# Altium project BLDC-Board-v1.0.PrjPcb (part 1 of 3)
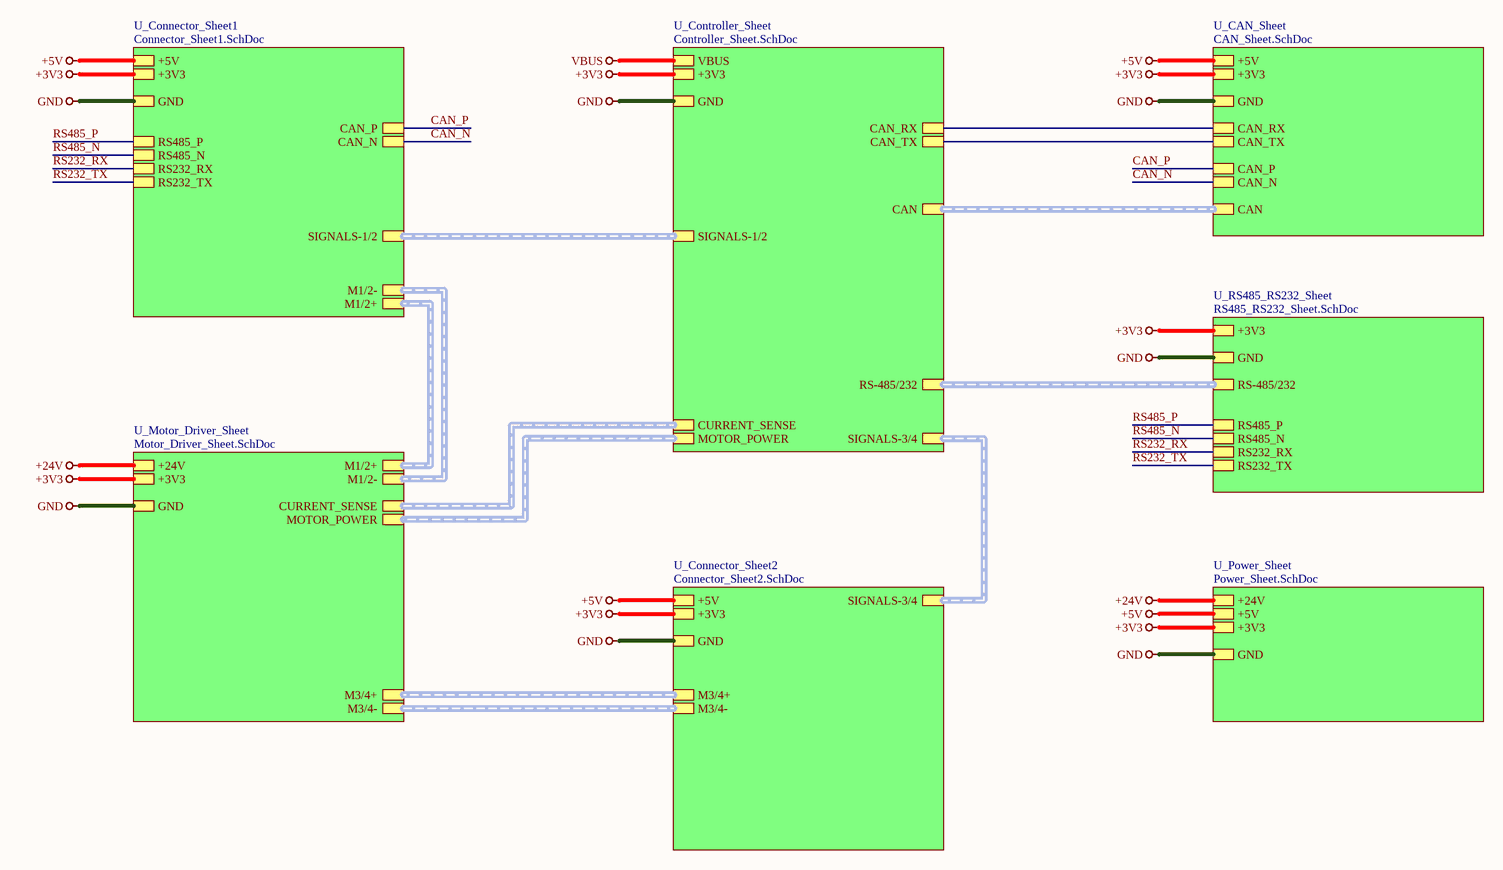
[diagram p0: Top_Sheet.SchDoc]
8 sheets, 211 parts. Net scope: hierarchical (ports join the sheet entries above them; power ports are global).
Board file: BLDC-Board-v1.0.PcbDoc
Sheets:
  Top_Sheet.SchDoc
    U_CAN_Sheet = CAN_Sheet.SchDoc
    U_Connector_Sheet1 = Connector_Sheet1.SchDoc
    U_Connector_Sheet2 = Connector_Sheet2.SchDoc
    U_Controller_Sheet = Controller_Sheet.SchDoc
    U_Motor_Driver_Sheet = Motor_Driver_Sheet.SchDoc
    U_Power_Sheet = Power_Sheet.SchDoc
    U_RS485_RS232_Sheet = RS485_RS232_Sheet.SchDoc

## Sheet Top_Sheet.SchDoc
size 420 x 297 mm; SheetNumber: 1; SheetTotal: 8

### Sub-sheets
U_CAN_Sheet = CAN_Sheet.SchDoc: CAN (harness CAN), CAN_RX, CAN_TX, CAN_P, CAN_N, +5V, +3V3, GND
U_Connector_Sheet1 = Connector_Sheet1.SchDoc: M1/2+ (harness M1/2+), M1/2- (harness M1/2-), CAN_P, CAN_N, RS485_N, RS485_P, RS232_RX, RS232_TX, SIGNALS-1/2 (harness SIGNALS-1/2), +5V, +3V3, GND
U_Connector_Sheet2 = Connector_Sheet2.SchDoc: M3/4+ (harness M3/4+), M3/4- (harness M3/4-), SIGNALS-3/4 (harness SIGNALS-3/4), +5V, +3V3, GND
U_Controller_Sheet = Controller_Sheet.SchDoc: CURRENT_SENSE (harness CURRENT_SENSE), MOTOR_POWER (harness MOTOR_POWER), CAN (harness CAN), CAN_RX, CAN_TX, RS-485/232 (harness RS-485/232), SIGNALS-3/4 (harness SIGNALS-3/4), SIGNALS-1/2 (harness SIGNALS-1/2), VBUS, +3V3, GND
U_Motor_Driver_Sheet = Motor_Driver_Sheet.SchDoc: M1/2+ (harness M1/2+), M3/4+ (harness M3/4+), M1/2- (harness M1/2-), M3/4- (harness M3/4-), CURRENT_SENSE (harness CURRENT_SENSE), MOTOR_POWER (harness MOTOR_POWER), +24V, +3V3, GND
U_Power_Sheet = Power_Sheet.SchDoc: +24V, +5V, +3V3, GND
U_RS485_RS232_Sheet = RS485_RS232_Sheet.SchDoc: RS485_N, RS485_P, RS232_RX, RS232_TX, RS-485/232 (harness RS-485/232), +3V3, GND

### Nets
+3V3: sheet U_CAN_Sheet/+3V3, sheet U_Connector_Sheet1/+3V3, sheet U_Connector_Sheet2/+3V3, sheet U_Controller_Sheet/+3V3, sheet U_Motor_Driver_Sheet/+3V3, sheet U_Power_Sheet/+3V3, sheet U_RS485_RS232_Sheet/+3V3
+5V: sheet U_CAN_Sheet/+5V, sheet U_Connector_Sheet1/+5V, sheet U_Connector_Sheet2/+5V, sheet U_Power_Sheet/+5V
+24V: sheet U_Motor_Driver_Sheet/+24V, sheet U_Power_Sheet/+24V
GND: sheet U_CAN_Sheet/GND, sheet U_Connector_Sheet1/GND, sheet U_Connector_Sheet2/GND, sheet U_Controller_Sheet/GND, sheet U_Motor_Driver_Sheet/GND, sheet U_Power_Sheet/GND, sheet U_RS485_RS232_Sheet/GND
VBUS: sheet U_Controller_Sheet/VBUS
CAN_N: sheet U_CAN_Sheet/CAN_N, sheet U_Connector_Sheet1/CAN_N
CAN_P: sheet U_CAN_Sheet/CAN_P, sheet U_Connector_Sheet1/CAN_P
CAN_RX: sheet U_CAN_Sheet/CAN_RX, sheet U_Controller_Sheet/CAN_RX
CAN_TX: sheet U_CAN_Sheet/CAN_TX, sheet U_Controller_Sheet/CAN_TX
RS232_RX: sheet U_Connector_Sheet1/RS232_RX, sheet U_RS485_RS232_Sheet/RS232_RX
RS232_TX: sheet U_Connector_Sheet1/RS232_TX, sheet U_RS485_RS232_Sheet/RS232_TX
RS485_N: sheet U_Connector_Sheet1/RS485_N, sheet U_RS485_RS232_Sheet/RS485_N
RS485_P: sheet U_Connector_Sheet1/RS485_P, sheet U_RS485_RS232_Sheet/RS485_P

### Buses and harness runs
harness sheet U_CAN_Sheet/CAN = sheet U_Controller_Sheet/CAN
harness sheet U_Connector_Sheet1/M1/2+ = sheet U_Motor_Driver_Sheet/M1/2+
harness sheet U_Connector_Sheet1/M1/2- = sheet U_Motor_Driver_Sheet/M1/2-
harness sheet U_Connector_Sheet1/SIGNALS-1/2 = sheet U_Controller_Sheet/SIGNALS-1/2
harness sheet U_Connector_Sheet2/M3/4+ = sheet U_Motor_Driver_Sheet/M3/4+
harness sheet U_Connector_Sheet2/M3/4- = sheet U_Motor_Driver_Sheet/M3/4-
harness sheet U_Connector_Sheet2/SIGNALS-3/4 = sheet U_Controller_Sheet/SIGNALS-3/4
harness sheet U_Controller_Sheet/CURRENT_SENSE = sheet U_Motor_Driver_Sheet/CURRENT_SENSE
harness sheet U_Controller_Sheet/MOTOR_POWER = sheet U_Motor_Driver_Sheet/MOTOR_POWER
harness sheet U_Controller_Sheet/RS-485/232 = sheet U_RS485_RS232_Sheet/RS-485/232

### Notes on the sheet
- File:
- Title:
- Date:
- Page
- Num:
- Total:
- Drawn By: Huzaifa Ali

## Sheet CAN_Sheet.SchDoc
size 420 x 297 mm; SheetNumber: 4; SheetTotal: 8
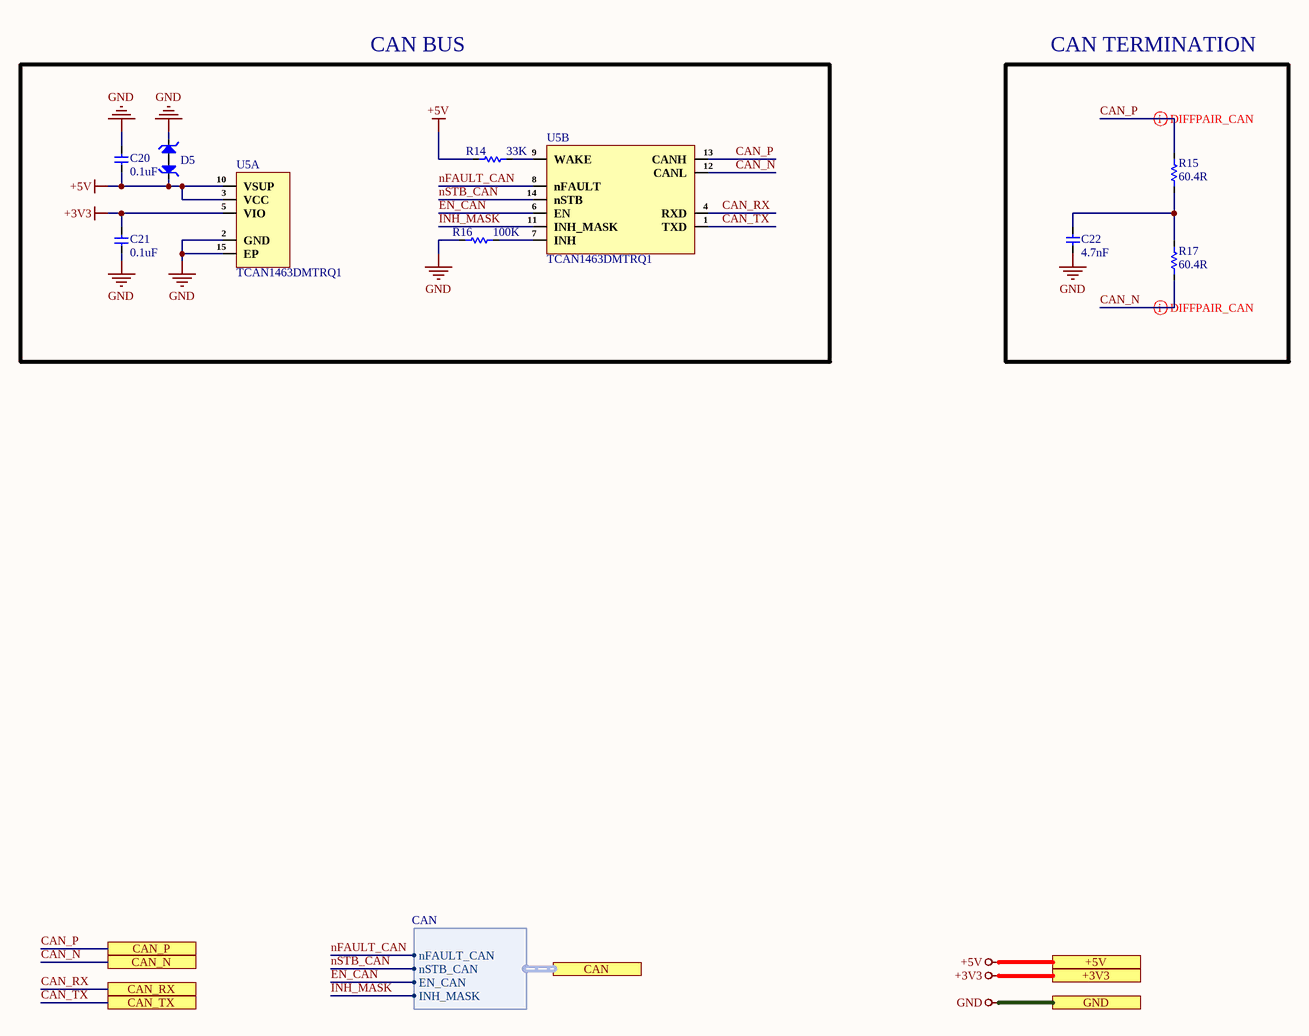
[diagram p1: CAN_Sheet.SchDoc]

### Parts
C20  0.1uF  [Cap-0402]
C21  0.1uF  [Cap-0402]
C22  4.7nF  [Cap-0402]
D5  PESD5V0H1BSFYL  [DSN0603-2]  (value not drawn)
R14  33K  [Res-0402]
R15  60.4R  [Res-0603]
R16  100K  [Res-0402]
R17  60.4R  [Res-0603]
U5  TCAN1463DMTRQ1  [VSON-14(3x4.5)]  (parts A,B of 2)

### Ports
+3V3 (see Top_Sheet[4A], Connector_Sheet1[5D], Connector_Sheet2[3D], Controller_Sheet[2D], Motor_Driver_Sheet[5D], Power_Sheet[5D], RS485_RS232_Sheet[5D]), +5V (see Top_Sheet[4A], Connector_Sheet1[5D], Connector_Sheet2[3D], Power_Sheet[5D]), CAN (harness CAN, see Top_Sheet[4B], Controller_Sheet[4D]), CAN_N (see Top_Sheet[4B], Connector_Sheet1[2D]), CAN_P (see Top_Sheet[4B], Connector_Sheet1[2D]), CAN_RX (see Top_Sheet[4B], Controller_Sheet[2D]), CAN_TX (see Top_Sheet[4B], Controller_Sheet[2D]), GND (see Top_Sheet[4B], Connector_Sheet1[5D], Connector_Sheet2[3D], Controller_Sheet[2D], Motor_Driver_Sheet[5D], Power_Sheet[5D], RS485_RS232_Sheet[5D])

### Harnesses
CAN: nFAULT_CAN, nSTB_CAN, EN_CAN, INH_MASK

### Nets
+3V3: C21.2 U5.5(VIO) ; port +3V3
+5V: C20.1 D5.1 R14.1 U5.3(VCC) U5.10(VSUP) ; port +5V
GND: C20.2 C21.1 C22.2 D5.2 R16.1 U5.2(GND) U5.15(EP) ; port GND
CAN_N: R17.2 U5.12(CANL) ; port CAN_N
CAN_P: R15.1 U5.13(CANH) ; port CAN_P
CAN_RX: U5.4(RXD) ; port CAN_RX
CAN_TX: U5.1(TXD) ; port CAN_TX
EN_CAN: U5.6(EN) ; port CAN.EN_CAN
INH_MASK: U5.11(INH_MASK) ; port CAN.INH_MASK
nFAULT_CAN: U5.8(nFAULT) ; port CAN.nFAULT_CAN
nSTB_CAN: U5.14(nSTB) ; port CAN.nSTB_CAN
NetC22_1: C22.1 R15.2 R17.1
NetR14_2: R14.2 U5.9(WAKE)
NetR16_2: R16.2 U5.7(INH)

### Layout directives
differential pair; net class CAN; differential pair class CAN_Lines: CAN_N, CAN_P

### Notes on the sheet
- CAN BUS
- CAN TERMINATION
- File:
- Title:
- Date:
- Page
- Num:
- Total:
- Drawn By: Huzaifa Ali

### Library data of the parts
C20 C21 = CC0402JRX7R7BB104: CAP CER 0.1UF 16V X7R 0402; Manufacturer: Yageo; Material: 4241ConductorMaterial; Value: 100nF; Tolerance: 5%; Item Type: Capacitor; Supplier: Digikey; Supplier Part Number: 311-1676-1-ND; Manufacturer Part Number: CC0402JRX7R7BB104; RoHS: Yes; Category: Ceramic Capacitors; Stock: 1659111; Pricing: 1=0.1, 10=0.046, 50=0.0262, 100=0.0203, 500=0.01528, 1000=0.012, 2500=0.01091, 5000=0.01004 (USD); Mounting Technology: Surface Mount; Case/Package: 0402; Case Code (Metric): 1005; Case Code (Imperial): 0402; Min Operating Temperature: -55°C; Max Operating Temperature: 125°C; Dielectric: X7R; Packaging: Tape and Reel; Package Quantity: 10000; Voltage Rating (DC): 16V; Voltage Rating: 16V; Series: CC; Construction: Flat; Length: 0.039inch; Width: 0.02inch; Height: 0.5mm; Thickness: 0.022inch; Lead Free: Lead Free; Halogen Free: Halogen Free; RoHS Compliant: Yes; ComponentLink1URL: https://datasheet.ciiva.com/13210/upy-gphc-x7r-6-3v-to-50v-8-12304-13210152.pdf?src-supplier=Mouser; ComponentLink1Description: https://datasheet.ciiva.com/13210/upy-gphc-x7r-6-3v-to-50v-8-12304-13210152.pdf?src-supplier=Mouser; LCSC Part Number: C541464
C22 = CC0402KRX7R9BB472: CAP CER 4700PF 50V X7R 0402; Manufacturer: Yageo; Material: 4241ConductorMaterial; Tolerance: 10%; Temperature Coefficient: 30ppm/°C; Item Type: Capacitor; Supplier 1: Future Electronics; Manufacturer Part Number: CC0402KRX7R9BB472; RoHS: Yes; Category: Ceramic Capacitors; Stock 1: 1780000; Pricing 1: 10000=0.0021, 40000=0.002, 150000=0.0019, 400000=0.0018, 1000000=0.0017 (USD); Mount: Surface Mount; Case/Package: 0402; Number of Pins: 2NUMBER; Case Code (Imperial): 0402; Case Code (Metric): 1005; Min Operating Temperature: -55°C; Max Operating Temperature: 125°C; Capacitance: 4.7nF; Dielectric: X7R; Voltage Rating: 50V; Voltage Rating (DC): 50V; Packaging: Tape and Reel; Package Quantity: 1; Termination: SMD/SMT; Series: CC; Construction: Flat; Length: 1mm; Width: 0.02inch; Height: 0.5mm; Thickness: 0.022inch; Depth: 0.5mm; Radiation Hardening: No; Reach SVHC Compliant: No; RoHS Compliant: Yes; Halogen Free: 5694HalogenFree; Lead Free: 5697LeadFree; ComponentLink1URL: https://datasheet.ciiva.com/7978/1489800-7978108.pdf?src-supplier=Element14; ComponentLink1Description: https://datasheet.ciiva.com/7978/1489800-7978108.pdf?src-supplier=Element14; ComponentLink2URL: https://datasheet.ciiva.com/176/mlccorderingcode-176364.pdf?src-supplier=Digikey; ComponentLink2Description: https://datasheet.ciiva.com/176/mlccorderingcode-176364.pdf?src-supplier=Digikey; ComponentLink3URL: https://datasheet.ciiva.com/176/mlccorderingcode-176363.pdf?src-supplier=Digikey; ComponentLink3Description: https://datasheet.ciiva.com/176/mlccorderingcode-176363.pdf?src-supplier=Digikey; ComponentLink4URL: https://datasheet.ciiva.com/176/mlccorderingcode-176365.pdf?src-supplier=Digikey; ComponentLink4Description: https://datasheet.ciiva.com/176/mlccorderingcode-176365.pdf?src-supplier=Digikey; ComponentLink5URL: https://datasheet.ciiva.com/11586/upy-gphc-x7r-6-3v-to-50v-8-11586491.pdf?src-supplier=Avnet; ComponentLink5Description: https://datasheet.ciiva.com/11586/upy-gphc-x7r-6-3v-to-50v-8-11586491.pdf?src-supplier=Avnet; Supplier Part Number 1: 1989300
D5 = PESD5V0H1BSFYL: TVS DIODE 5VWM 6.3VC DSN0603-2; Manufacturer: Nexperia; Supplier 1: Avnet; Manufacturer Part Number: PESD5V0H1BSFYL; RoHS: Yes; Category: ESD and Circuit Protection ICs; Stock 1: 9000; Pricing 1: 18000=0.06453, 36000=0.06278, 54000=0.06104, 90000=0.05930, 180000=0.05755, 900000=0.05581, 1800000=0.05406 (USD); RoHS Compliant: Yes; ComponentLink1URL: http://www.farnell.com/datasheets/1961312.pdf?src-supplier=Farnell; ComponentLink1Description: http://www.farnell.com/datasheets/1961312.pdf?src-supplier=Farnell; ComponentLink2URL: https://assets.nexperia.com/documents/data-sheet/PESD5V0H1BSF.pdf?src-supplier=Digi-Key; ComponentLink2Description: https://assets.nexperia.com/documents/data-sheet/PESD5V0H1BSF.pdf?src-supplier=Digi-Key; ComponentLink3URL: http://www.farnell.com/datasheets/1961312.pdf?src-supplier=Newark; ComponentLink3Description: http://www.farnell.com/datasheets/1961312.pdf?src-supplier=Newark; Supplier Part Number 1: PESD5V0H1BSFYL; LCSC Part Number: C477989; Item Type: Diode
R14 = RC0402FR-0733KL: RES 33K OHM 1% 1/16W 0402; Manufacturer: YAGEO; Item Type: Resistor; Manufacturer Part Number: RC0402FR-0733KL; Package: 0402; LCSC Part Number: C138003; ComponentLink1Description: LCSC; ComponentLink1URL: https://www.lcsc.com/product-detail/Chip-Resistor-Surface-Mount_YAGEO-RC0402FR-0733KL_C138003.html
R15 R17 = RTT0360R4FTP: 100mW Thick Film Resistors ±100ppm/℃ ±1% 60.4Ω 0603 Chip Resistor - Surface Mount ROHS; Manuacturer: RALEC; Manufacturer Part Number: RTT0360R4FTP; Package: 0603; Value: 60.4R; LCSC Part Number: C103744; ComponentLink1Description: LCSC; ComponentLink1URL: https://www.lcsc.com/product-detail/Chip-Resistor-Surface-Mount_RALEC-RTT0360R4FTP_C103744.html
R16 = RC0402FR-07100KL: RES 100K OHM 1% 1/16W 0402; Manufacturer: Yageo; Resistance: 100kR; Temperature Coefficient: 100ppm/°C; Power Rating: 63mW; Voltage Rating: 50V; Item Type: Resistor; Supplier 1: Mouser; Manufacturer Part Number: RC0402FR-07100KL; RoHS: Yes; Category: Chip SMD Resistors; Stock 1: 7759549; Pricing 1: 1=0.10000, 10=0.01200, 50=0.01200, 100=0.00500, 1000=0.00300, 2500=0.00200, 10000=0.00100 (USD); Case/Package: 0402; Case Code (Metric): 1005; Case Code (Imperial): 0402; Min Operating Temperature: -55°C; Max Operating Temperature: 155°C; Resistor Type: Thick Film; Tolerance: 1%; Packaging: Tape and Reel; Package Quantity: 1; Number of Terminations: 2; Termination: SMD/SMT; Max Power Dissipation: 63mW; Working Voltage: 50V; Features: Moisture Resistant; Series: RC; Resistance Tolerance: 1%; Construction: Rectangular; Technology: THICK FILM; Length: 0.039inch; Width: 0.02inch; Height: 0.016inch; Depth: 0.5mm; REACH SVHC: No SVHC; Lead Free: Lead Free; RoHS Compliant: Yes; Military Standard: Not; ComponentLink1URL: https://datasheet.ciiva.com/11819/0900766b80c66297-11819452.pdf?src-supplier=RSComponents; ComponentLink1Description: https://datasheet.ciiva.com/11819/0900766b80c66297-11819452.pdf?src-supplier=RSComponents; ComponentLink2URL: https://datasheet.ciiva.com/22747/1018594-22747509.pdf?src-supplier=Element14; ComponentLink2Description: https://datasheet.ciiva.com/22747/1018594-22747509.pdf?src-supplier=Element14; ComponentLink3URL: https://datasheet.ciiva.com/2453/pyu-r-int-thick-7-2453362.pdf?src-supplier=Digi-Key; ComponentLink3Description: https://datasheet.ciiva.com/2453/pyu-r-int-thick-7-2453362.pdf?src-supplier=Digi-Key; ComponentLink4URL: https://datasheet.ciiva.com/2453/pyu-r-int-thick-7-2453363.pdf?src-supplier=Digi-Key; ComponentLink4Description: https://datasheet.ciiva.com/2453/pyu-r-int-thick-7-2453363.pdf?src-supplier=Digi-Key; ComponentLink5URL: https://datasheet.ciiva.com/2453/pyu-r-int-thick-7-2453361.pdf?src-supplier=Digi-Key; ComponentLink5Description: https://datasheet.ciiva.com/2453/pyu-r-int-thick-7-2453361.pdf?src-supplier=Digi-Key; ComponentLink6URL: https://datasheet.ciiva.com/12667/pyu-rc0402-51-rohs-l-6-r-12667930.pdf?src-supplier=Mouser; ComponentLink6Description: https://datasheet.ciiva.com/12667/pyu-rc0402-51-rohs-l-6-r-12667930.pdf?src-supplier=Mouser; ComponentLink7URL: https://datasheet.ciiva.com/15189/getdatasheetpartid-323696-15189334.pdf?src-supplier=Verical; ComponentLink7Description: https://datasheet.ciiva.com/15189/getdatasheetpartid-323696-15189334.pdf?src-supplier=Verical; Supplier Part Number 1: 603-RC0402FR-07100KL; LCSC Part Number: C60491
U5 = TCAN1463DMTRQ1: IC TRANSCEIVER HALF 1/1 14VSON; Manufacturer: Texas Instruments; Supplier: Mouser; Supplier Part Number: 595-TCAN1463DMTRQ1; Manufacturer Part Number: TCAN1463DMTRQ1; RoHS: Yes; Item Type: IC; Stock: 20610; Pricing: 1=2.47, 10=2.22, 50=2.22, 100=1.78, 1000=1.21, 10000=1.09 (USD); LCSC Part Number: C5215823

## Sheet Connector_Sheet1.SchDoc
size 420 x 297 mm; SheetNumber: 7; SheetTotal: 8
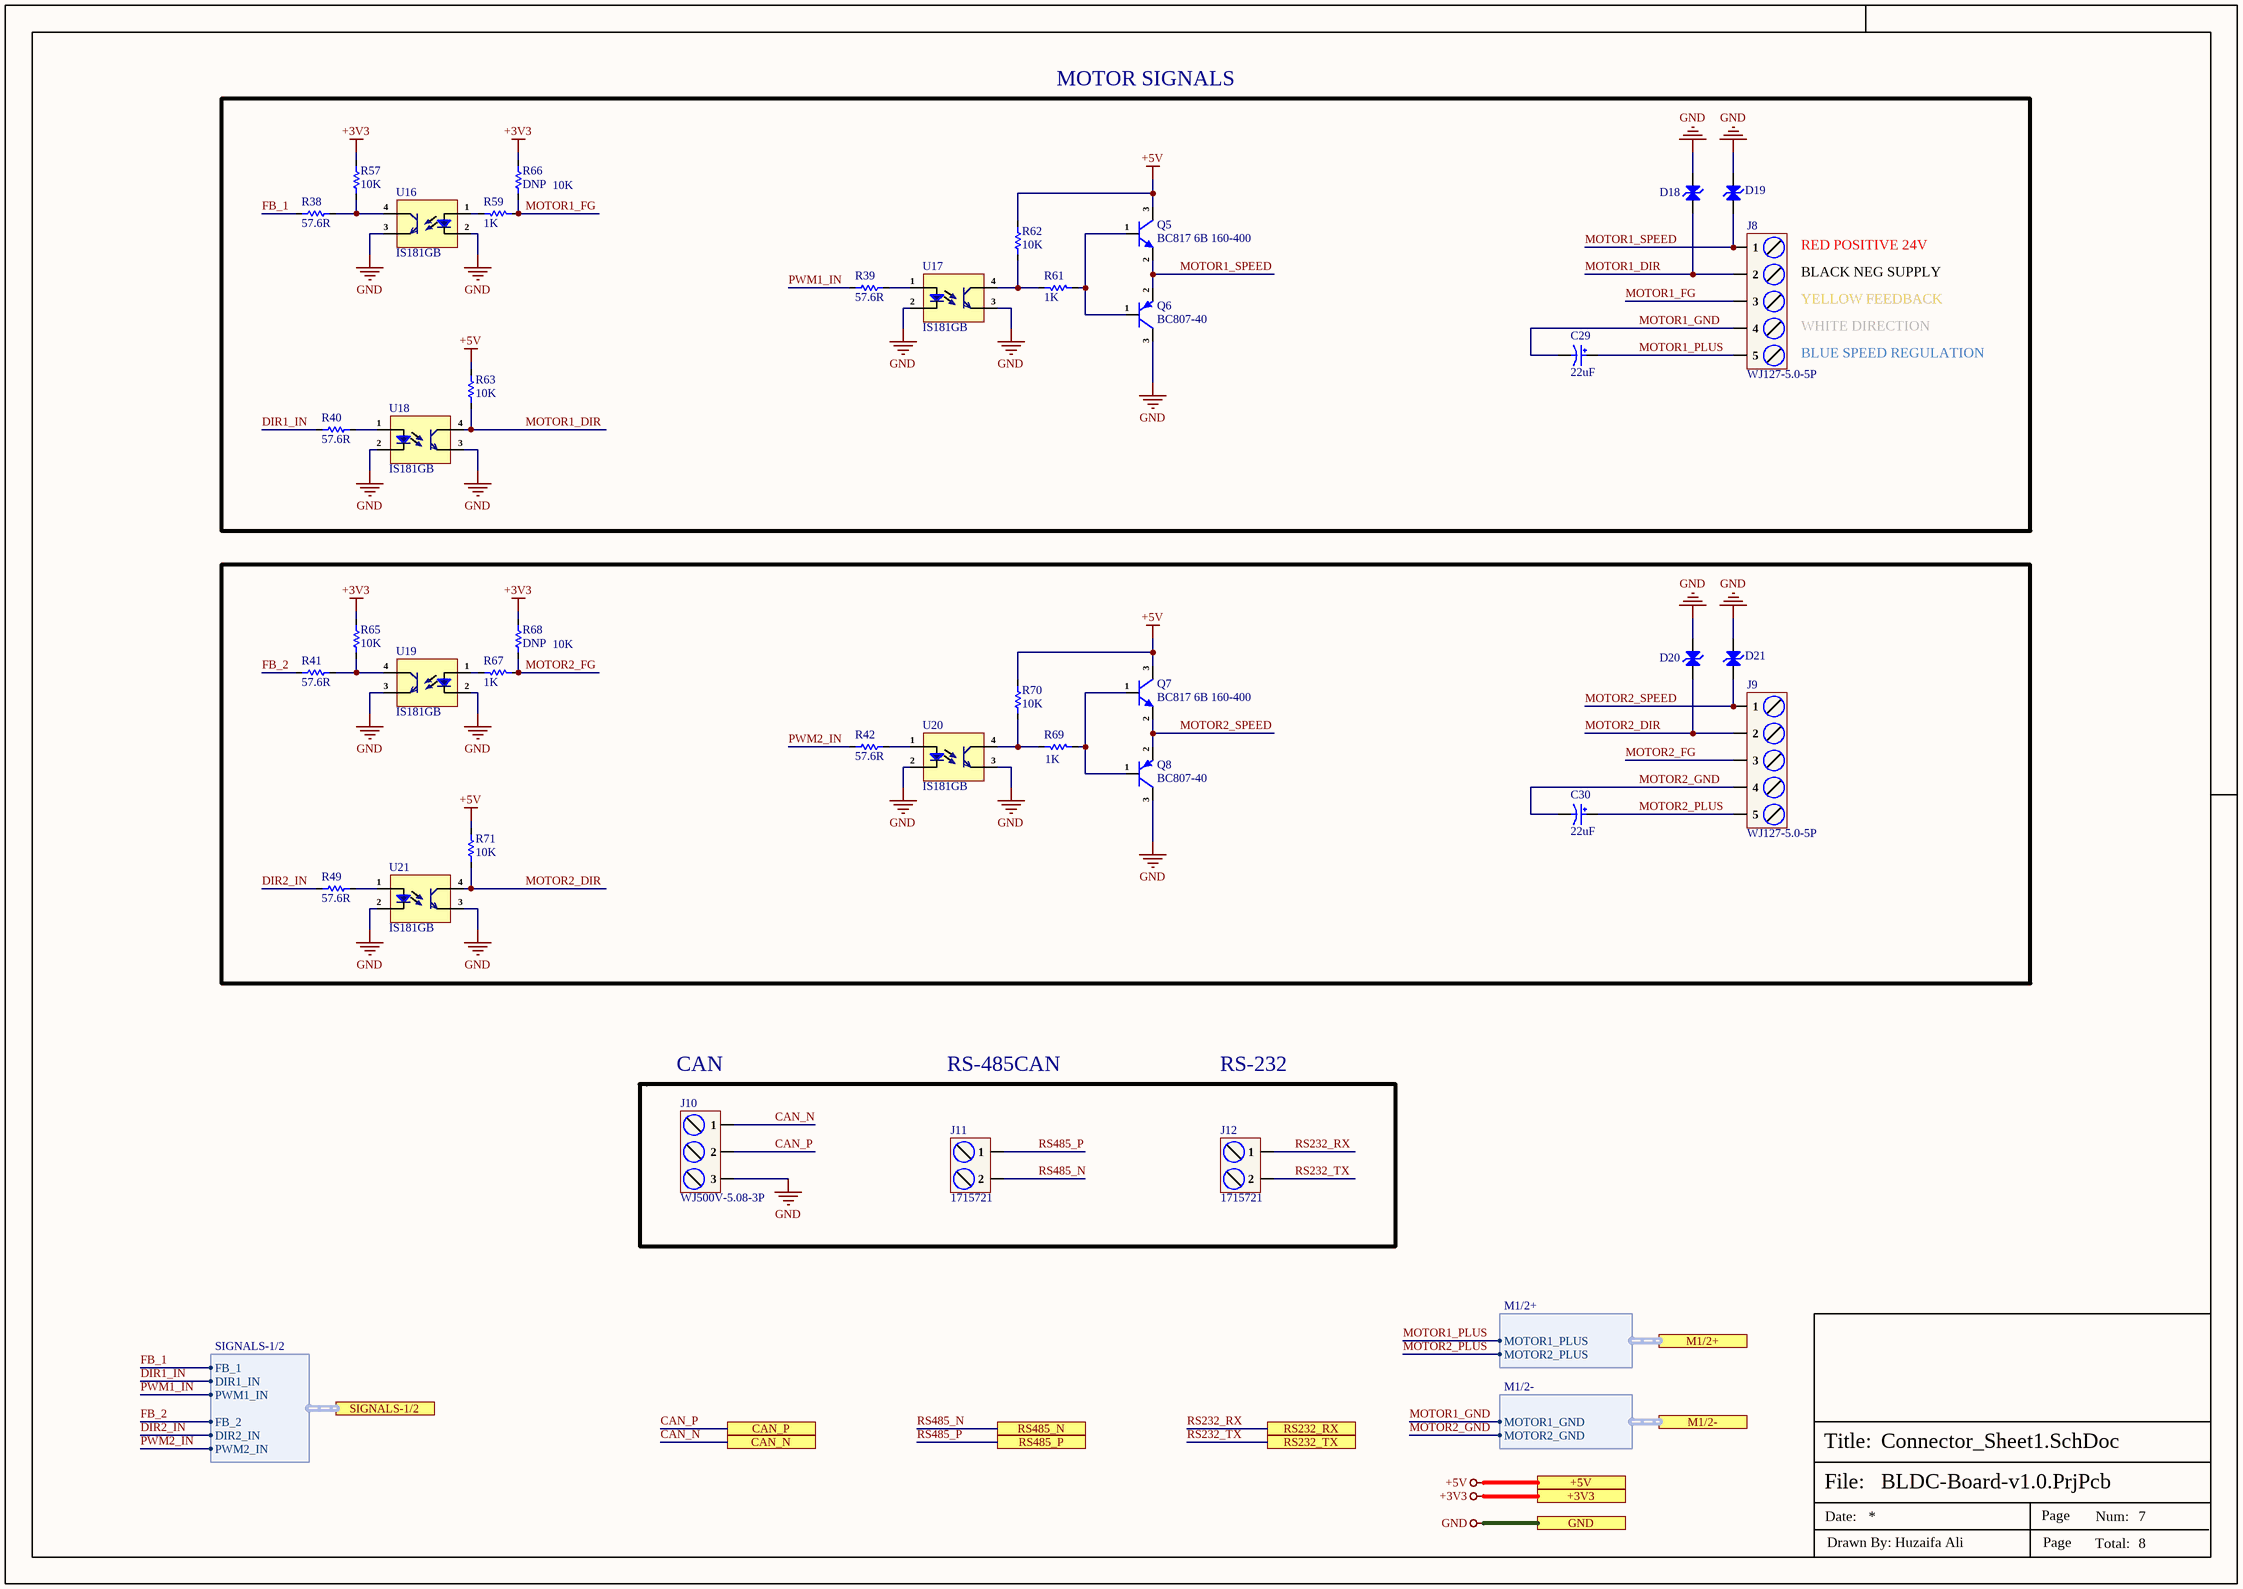
[diagram p2: Connector_Sheet1.SchDoc]

### Parts
C29  22uF  [VKMD1652D220MV]
C30  22uF  [VKMD1652D220MV]
D18  ESD5B5.0ST1G  [SOD-523]  (value not drawn)
D19  ESD5B5.0ST1G  [SOD-523]  (value not drawn)
D20  ESD5B5.0ST1G  [SOD-523]  (value not drawn)
D21  ESD5B5.0ST1G  [SOD-523]  (value not drawn)
J8  WJ127-5.0-5P  [WJ127-5.0-5P]
J9  WJ127-5.0-5P  [WJ127-5.0-5P]
J10  WJ500V-5.08-3P  [WJ500V-5.08-3P]
J11  1715721  [1715721]
J12  1715721  [1715721]
Q5  BC817 6B 160-400  [SOT-23]
Q6  BC807-40  [SOT-23]
Q7  BC817 6B 160-400  [SOT-23]
Q8  BC807-40  [SOT-23]
R38  57.6R  [Res-0402]
R39  57.6R  [Res-0402]
R40  57.6R  [Res-0402]
R41  57.6R  [Res-0402]
R42  57.6R  [Res-0402]
R49  57.6R  [Res-0402]
R57  10K  [Res-0402]
R59  1K  [Res-0402]
R61  1K  [Res-0402]
R62  10K  [Res-0402]
R63  10K  [Res-0402]
R65  10K  [Res-0402]
R66  DNP  [Res-0402]
R67  1K  [Res-0402]
R68  DNP  [Res-0402]
R69  1K  [Res-0402]
R70  10K  [Res-0402]
R71  10K  [Res-0402]
U16  IS181GB  [SOP-4_2.54]
U17  IS181GB  [SOP-4_2.54]
U18  IS181GB  [SOP-4_2.54]
U19  IS181GB  [SOP-4_2.54]
U20  IS181GB  [SOP-4_2.54]
U21  IS181GB  [SOP-4_2.54]

### Blocks framed on the sheet
10K: C30 D20 D21 J9 Q7 Q8 R41 R42 R49 R65 R67-R71 U19-U21

### Ports
+3V3 (see Top_Sheet[2A], CAN_Sheet[5D], Connector_Sheet2[3D], Controller_Sheet[2D], Motor_Driver_Sheet[5D], Power_Sheet[5D], RS485_RS232_Sheet[5D]), +5V (see Top_Sheet[2A], CAN_Sheet[5D], Connector_Sheet2[3D], Power_Sheet[5D]), CAN_N (see Top_Sheet[2B], CAN_Sheet[2D]), CAN_P (see Top_Sheet[2B], CAN_Sheet[2D]), GND (see Top_Sheet[2B], CAN_Sheet[5D], Connector_Sheet2[3D], Controller_Sheet[2D], Motor_Driver_Sheet[5D], Power_Sheet[5D], RS485_RS232_Sheet[5D]), M1/2+ (harness M1/2+, see Top_Sheet[2B], Motor_Driver_Sheet[3D]), M1/2- (harness M1/2-, see Top_Sheet[2B], Motor_Driver_Sheet[2D]), RS232_RX (see Top_Sheet[2B], RS485_RS232_Sheet[4D]), RS232_TX (see Top_Sheet[2B], RS485_RS232_Sheet[4D]), RS485_N (see Top_Sheet[2B], RS485_RS232_Sheet[4D]), RS485_P (see Top_Sheet[2B], RS485_RS232_Sheet[4D]), SIGNALS-1/2 (harness SIGNALS-1/2, see Top_Sheet[2B], Controller_Sheet[1D])

### Harnesses
M1/2+: MOTOR1_PLUS, MOTOR2_PLUS
M1/2-: MOTOR1_GND, MOTOR2_GND
SIGNALS-1/2: FB_1, DIR1_IN, PWM1_IN, FB_2, DIR2_IN, PWM2_IN

### Nets
+3V3: R57.2 R65.2 R66.2 R68.2 ; port +3V3
+5V: Q5.3(C) Q7.3(C) R62.1 R63.2 R70.1 R71.2 ; port +5V
GND: D18.2(A) D19.2(A) D20.2(A) D21.2(A) J10.3 Q6.3(C) Q8.3(C) U16.2(Ca) U16.3(E) U17.2(Ca) U17.3(E) U18.2(Ca) U18.3(E) U19.2(Ca) U19.3(E) U20.2(Ca) U20.3(E) U21.2(Ca) U21.3(E) ; port GND
CAN_N: J10.1 ; port CAN_N
CAN_P: J10.2 ; port CAN_P
DIR1_IN: R40.1 ; port SIGNALS-1/2.DIR1_IN
DIR2_IN: R49.1 ; port SIGNALS-1/2.DIR2_IN
FB_1: R38.1 ; port SIGNALS-1/2.FB_1
FB_2: R41.1 ; port SIGNALS-1/2.FB_2
MOTOR1_DIR: D18.1(A) J8.2 R63.1 U18.4(C)
MOTOR1_FG: J8.3 R59.1 R66.1
MOTOR1_GND: C29.2 J8.4 ; port M1/2-.MOTOR1_GND
MOTOR1_PLUS: C29.1 J8.5 ; port M1/2+.MOTOR1_PLUS
MOTOR1_SPEED: D19.1(A) J8.1 Q5.2(E) Q6.2(E)
MOTOR2_DIR: D20.1(A) J9.2 R71.1 U21.4(C)
MOTOR2_FG: J9.3 R67.1 R68.1
MOTOR2_GND: C30.2 J9.4 ; port M1/2-.MOTOR2_GND
MOTOR2_PLUS: C30.1 J9.5 ; port M1/2+.MOTOR2_PLUS
MOTOR2_SPEED: D21.1(A) J9.1 Q7.2(E) Q8.2(E)
PWM1_IN: R39.1 ; port SIGNALS-1/2.PWM1_IN
PWM2_IN: R42.1 ; port SIGNALS-1/2.PWM2_IN
RS232_RX: J12.1 ; port RS232_RX
RS232_TX: J12.2 ; port RS232_TX
RS485_N: J11.2 ; port RS485_N
RS485_P: J11.1 ; port RS485_P
NetQ5_1: Q5.1(B) Q6.1(B) R61.1
NetQ7_1: Q7.1(B) Q8.1(B) R69.1
NetR38_2: R38.2 R57.1 U16.4(C)
NetR39_2: R39.2 U17.1(An)
NetR40_2: R40.2 U18.1(An)
NetR41_2: R41.2 R65.1 U19.4(C)
NetR42_2: R42.2 U20.1(An)
NetR49_2: R49.2 U21.1(An)
NetR59_2: R59.2 U16.1(An)
NetR61_2: R61.2 R62.2 U17.4(C)
NetR67_2: R67.2 U19.1(An)
NetR69_2: R69.2 R70.2 U20.4(C)

### Notes on the sheet
- MOTOR SIGNALS
- 10K
- RED POSITIVE 24V
- BLACK NEG SUPPLY
- YELLOW FEEDBACK
- WHITE DIRECTION
- BLUE SPEED REGULATION
- (near J10) CAN
- RS-485CAN
- RS-232
- File:
- Title:
- Date:
- Page
- Num:
- Total:
- Drawn By: Huzaifa Ali

### Library data of the parts
C29 C30 = VKMD1652D220MV: 22uF 200V 320mA@100kHz ±20% SMD,D8xL16.5mm Aluminum Electrolytic Capacitors - SMD ROHS; Manufacturer: Ymin; Manufacturer Part Number: VKMD1652D220MV; Package: SMD,D8xL16.5mm; LCSC Part Number: C487500; Item Type: Electrolytic Capacitor; ComponentLink1Description: LCSC; ComponentLink1URL: https://www.lcsc.com/product-detail/Aluminum-Electrolytic-Capacitors-SMD_Ymin-VKMD1652D220MV_C487500.html
D18-D21 = ESD5B5.0ST1G: TVS DIODE 5VWM SOD523; Manufacturer: ON Semiconductor; Item Type: ESD Protection Device; Supplier: Future Electronics; Supplier Part Number: 1159725; Manufacturer Part Number: ESD5B5.0ST1G; RoHS: Yes; Category: ESD and Circuit Protection ICs; Stock: 486000; Pricing: 3000=0.0396, 9000=0.0381, 15000=0.0375, 60000=0.0357, 90000=0.0346 (USD); ComponentLink1URL: https://datasheet.ciiva.com/339/esd5b5-0st1g-339772.pdf?src-supplier=Avnet; ComponentLink1Description: https://datasheet.ciiva.com/339/esd5b5-0st1g-339772.pdf?src-supplier=Avnet; ComponentLink2URL: https://datasheet.ciiva.com/339/esd5b5-0st1g-339772.pdf?src-supplier=Digi-Key; ComponentLink2Description: https://datasheet.ciiva.com/339/esd5b5-0st1g-339772.pdf?src-supplier=Digi-Key; ComponentLink3URL: https://datasheet.ciiva.com/22637/716649-22637178.pdf?src-supplier=Element14; ComponentLink3Description: https://datasheet.ciiva.com/22637/716649-22637178.pdf?src-supplier=Element14; ComponentLink4URL: https://datasheet.ciiva.com/4510/esd5b5-0st1g-241623-4510548.pdf?src-supplier=Mouser; ComponentLink4Description: https://datasheet.ciiva.com/4510/esd5b5-0st1g-241623-4510548.pdf?src-supplier=Mouser; ComponentLink5URL: https://datasheet.ciiva.com/339/esd5b5-0st1-d-339773.pdf?src-supplier=Digi-Key; ComponentLink5Description: https://datasheet.ciiva.com/339/esd5b5-0st1-d-339773.pdf?src-supplier=Digi-Key; ComponentLink6URL: https://datasheet.ciiva.com/339/esd5b5-0st1-d-339774.pdf?src-supplier=Digi-Key; ComponentLink6Description: https://datasheet.ciiva.com/339/esd5b5-0st1-d-339774.pdf?src-supplier=Digi-Key; LCSC Part Number: C93623
J8 J9 = WJ127-5.0-5P: 1x5P -40℃~+105℃ 15A 250V Green 14~26 Straight pin 5mm 1.5 1 5 Plugin,P=5mm Screw terminal ROHS; Manufacturer: Ningbo Kangnex Elec; ComponentLink1Description: LCSC; ComponentLink1URL: https://www.lcsc.com/product-detail/Screw-terminal_Ningbo-Kangnex-Elec-WJ127-5-0-5P_C192780.html; Manufacturer Part Number: WJ127-5.0-5P; Package: Plugin,P=5mm; LCSC Part Number: C192780; Item Type: Screw terminal
J10 = WJ500V-5.08-3P: 1x3P 18A -40℃~+105℃ 250V Green 14~30 Straight pin 5.08mm 2.5 1 3 Plugin,P=5.08mm Screw terminal ROHS; Manufacturer: Ningbo Kangnex Elec; Item Type: Terminal Block; Manufacturer Part Number: WJ500V-5.08-3P; Package: Plugin,P=5.08mm; LCSC Part Number: C72334; ComponentLink1Description: LCSC; ComponentLink1URL: https://www.lcsc.com/product-detail/Screw-terminal_Ningbo-Kangnex-Elec-WJ500V-5-08-3P_C72334.html
J11 J12 = 1715721: TERM BLK 2P SIDE ENT 5.08MM PCB; Manufacturer: Phoenix Contact; Item Type: Terminal Blocks; Supplier: Digikey; Supplier Part Number: 277-1263-ND; Manufacturer Part Number: 1715721; RoHS: Yes; Stock: 13160; Pricing: 1=0.94 (USD); ComponentLink1URL: https://datasheet.ciiva.com/1120/1697161-1120393.pdf?src-supplier=Farnell; ComponentLink1Description: https://datasheet.ciiva.com/1120/1697161-1120393.pdf?src-supplier=Farnell; ComponentLink2URL: https://datasheet.ciiva.com/832/1715721-832095.pdf?src-supplier=Digikey; ComponentLink2Description: https://datasheet.ciiva.com/832/1715721-832095.pdf?src-supplier=Digikey; ComponentLink3URL: https://datasheet.ciiva.com/15169/getdatasheetpartid-212174-15169929.pdf?src-supplier=Verical; ComponentLink3Description: https://datasheet.ciiva.com/15169/getdatasheetpartid-212174-15169929.pdf?src-supplier=Verical; ComponentLink4URL: https://datasheet.ciiva.com/16046/1715721-16046034.pdf?src-supplier=Onlinecomponents.com; ComponentLink4Description: https://datasheet.ciiva.com/16046/1715721-16046034.pdf?src-supplier=Onlinecomponents.com
Q5 Q7 = BC817 6B 160-400: 45V 300mW 100@100mA,1V 500mA NPN SOT-23 Bipolar Transistors - BJT ROHS; Manufacturer: DOWO; Manufacturer Part Number: BC817 6B 160-400; Package: SOT-23; LCSC Part Number: C371086; Item Type: Transistor; ComponentLink1Description: LCSC; ComponentLink1URL: https://www.lcsc.com/product-detail/Bipolar-Transistors-BJT_DOWO-BC817-6B-160-400_C371086.html
Q6 Q8 = BC807-40: 45V 310mW 250@100mA,1V 800mA SOT-23 Bipolar (BJT) ROHS; Manufacturer: KEXIN; Item Type: (BJT); Manufacturer Part Number: BC807-40; Package: SOT-23; LCSC Part Number: C489159; ComponentLink1Description: LCSC; ComponentLink1URL: https://www.lcsc.com/product-detail/Bipolar-BJT_KEXIN-BC807-40_C489159.html
R38-R42 R49 = ERJ-2RKF57R6X: RES SMD 57.6 OHM 1% 1/10W 0402; Manufacturer: Panasonic; Item Type: Resistors; Supplier: Mouser; Supplier Part Number: 667-ERJ-2RKF57R6X; Manufacturer Part Number: ERJ-2RKF57R6X; RoHS: Yes; Stock: 32931; Pricing: 1=0.1, 10=0.015, 50=0.015, 100=0.009, 1000=0.006, 10000=0.003 (USD); ComponentLink1URL: https://datasheet.ciiva.com/9188/aoa0000ce2-9188571.pdf?src-supplier=Avnet; ComponentLink1Description: https://datasheet.ciiva.com/9188/aoa0000ce2-9188571.pdf?src-supplier=Avnet; ComponentLink2URL: https://datasheet.ciiva.com/9188/aoa0000ce2-9188574.pdf?src-supplier=Avnet; ComponentLink2Description: https://datasheet.ciiva.com/9188/aoa0000ce2-9188574.pdf?src-supplier=Avnet; ComponentLink3URL: https://datasheet.ciiva.com/24026/aoa0000ce2-24026248.pdf?src-supplier=Mouser; ComponentLink3Description: https://datasheet.ciiva.com/24026/aoa0000ce2-24026248.pdf?src-supplier=Mouser; ComponentLink4URL: https://datasheet.ciiva.com/43467/1678782-43467198.pdf?src-supplier=Farnell; ComponentLink4Description: https://datasheet.ciiva.com/43467/1678782-43467198.pdf?src-supplier=Farnell; ComponentLink5URL: https://datasheet.ciiva.com/46372/1678782-46372935.pdf?src-supplier=Element14; ComponentLink5Description: https://datasheet.ciiva.com/46372/1678782-46372935.pdf?src-supplier=Element14; ComponentLink6URL: https://datasheet.ciiva.com/46372/1678782-46372936.pdf?src-supplier=Element14; ComponentLink6Description: https://datasheet.ciiva.com/46372/1678782-46372936.pdf?src-supplier=Element14; ComponentLink7URL: https://datasheet.ciiva.com/22668/1678782-22668391.pdf?src-supplier=Element14; ComponentLink7Description: https://datasheet.ciiva.com/22668/1678782-22668391.pdf?src-supplier=Element14; ComponentLink8URL: https://datasheet.ciiva.com/22743/1678782-22743894.pdf?src-supplier=Element14; ComponentLink8Description: https://datasheet.ciiva.com/22743/1678782-22743894.pdf?src-supplier=Element14; ComponentLink9URL: https://datasheet.ciiva.com/30107/aoa0000ce2-30107676.pdf?src-supplier=Onlinecomponents.com; ComponentLink9Description: https://datasheet.ciiva.com/30107/aoa0000ce2-30107676.pdf?src-supplier=Onlinecomponents.com; LCSC Part Number: C3025671
R57 R62 R63 R65 R66 R68 R70 R71 = RC0402FR-0710KL: RES 10K OHM 1% 1/16W 0402; Manufacturer: Yageo; Resistance: 10kR; Voltage Rating (DC): 50V; Temperature Coefficient: 100ppm/°C; Power Rating: 62.5mW; Max Power Dissipation: 63mW; Item Type: Resistor; Supplier 1: Mouser; Manufacturer Part Number: RC0402FR-0710KL; RoHS: Yes; Category: Chip SMD Resistors; Stock 1: 18648329; Pricing 1: 1=0.10000, 10=0.01400, 50=0.01400, 100=0.00500, 1000=0.00300, 10000=0.00200 (USD); Case/Package: 0402; Number of Pins: 2; Case Code (Imperial): 0402; Case Code (Metric): 1005; Min Operating Temperature: -55°C; Max Operating Temperature: 155°C; Resistor Type: Thick Film; Tolerance: 1%; Packaging: Tape and Reel; Voltage Rating: 50V; Termination: SMD/SMT; Working Voltage: 50V; Number of Terminations: 2; Features: Moisture Resistant; Series: RC; Resistance Tolerance: 1%; Construction: Rectangular; Length: 1mm; Width: 0.5mm; Height: 0.32mm; Depth: 0.5mm; Lead Pitch: 0.2mm; REACH SVHC: No SVHC; Lead Free: Lead Free; RoHS Compliant: Yes; Military Standard: Not; ComponentLink1URL: https://datasheet.ciiva.com/7660/38568-7660787.pdf?src-supplier=Element14; ComponentLink1Description: https://datasheet.ciiva.com/7660/38568-7660787.pdf?src-supplier=Element14; ComponentLink2URL: https://datasheet.ciiva.com/7849/1686128-7849814.pdf?src-supplier=Element14; ComponentLink2Description: https://datasheet.ciiva.com/7849/1686128-7849814.pdf?src-supplier=Element14; ComponentLink3URL: https://datasheet.ciiva.com/7983/1018594-7983486.pdf?src-supplier=Element14; ComponentLink3Description: https://datasheet.ciiva.com/7983/1018594-7983486.pdf?src-supplier=Element14; ComponentLink4URL: https://datasheet.ciiva.com/22747/1018594-22747512.pdf?src-supplier=Element14; ComponentLink4Description: https://datasheet.ciiva.com/22747/1018594-22747512.pdf?src-supplier=Element14; ComponentLink5URL: https://datasheet.ciiva.com/12667/pyu-rc0402-51-rohs-l-6-r-12667067.pdf?src-supplier=Mouser; ComponentLink5Description: https://datasheet.ciiva.com/12667/pyu-rc0402-51-rohs-l-6-r-12667067.pdf?src-supplier=Mouser; ComponentLink6URL: https://datasheet.ciiva.com/7849/1784430-7849813.pdf?src-supplier=Element14; ComponentLink6Description: https://datasheet.ciiva.com/7849/1784430-7849813.pdf?src-supplier=Element14; ComponentLink7URL: https://datasheet.ciiva.com/7849/1784430-7849815.pdf?src-supplier=Element14; ComponentLink7Description: https://datasheet.ciiva.com/7849/1784430-7849815.pdf?src-supplier=Element14; Supplier Part Number 1: 603-RC0402FR-0710KL; LCSC Part Number: C60490
R59 R61 R67 R69 = CRCW04021K00FKEDHP: RES SMD 1K OHM 1% 1/5W 0402; Manufacturer: Vishay Dale; Resistance: 1kR; Temperature Coefficient: 100ppm/°C; Power Rating: 125mW; Voltage Rating: 50V; Supplier 1: Digi-Key; Manufacturer Part Number: CRCW04021K00FKEDHP; Stock 1: 315989; Pricing 1: 1=0.15, 10=0.132, 100=0.0506, 1000=0.02226, 2500=0.01923, 5000=0.0172 (USD); Mount: Surface Mount; Case/Package: 0402; Number of Pins: 2; Contact Plating: Tin; Weight: 2.3E-05oz; Case Code (Imperial): 0402; Case Code (Metric): 1005; Size Code: 0402; Min Operating Temperature: -55°C; Max Operating Temperature: 155°C; Tolerance: 1%; Resistor Type: Thick Film; Package Quantity: 10; Packaging: Tape and Reel; Number of Terminations: 2; Termination: SMD/SMT; Max Power Dissipation: 125mW; Voltage Rating (DC): 50V; Features: Automotive AEC-Q200; Series: CRCW-HP; Construction: Rectangular; Technology: THICK FILM; Resistance Tolerance: 1%; Length: 1mm; Width: 0.5mm; Height: 0.3mm; Depth: 0.5mm; Radiation Hardening: No; REACH SVHC: Unknown; Military Standard: Not; Lead Free: Lead Free; RoHS Compliant: Yes; ComponentLink1URL: http://www.farnell.com/datasheets/2339608.pdf?src-supplier=Element14; ComponentLink1Description: http://www.farnell.com/datasheets/2339608.pdf?src-supplier=Element14; ComponentLink2URL: http://www.vishay.com/docs/20043/crcwhpe3.pdf?src-supplier=Digi-Key; ComponentLink2Description: http://www.vishay.com/docs/20043/crcwhpe3.pdf?src-supplier=Digi-Key; ComponentLink3URL: http://www.mouser.com/ds/2/427/crcwhpe3-46056.pdf?src-supplier=Mouser; ComponentLink3Description: http://www.mouser.com/ds/2/427/crcwhpe3-46056.pdf?src-supplier=Mouser; ComponentLink4URL: http://www.vishay.com/docs/20043/crcwhpe3.pdf?src-supplier=Avnet; ComponentLink4Description: http://www.vishay.com/docs/20043/crcwhpe3.pdf?src-supplier=Avnet; ComponentLink5URL: http://www.vishay.com/docs/20043/crcwhpe3.pdf?src-supplier=Future+Electronics; ComponentLink5Description: http://www.vishay.com/docs/20043/crcwhpe3.pdf?src-supplier=Future+Electronics; Supplier Part Number 1: 541-1.00KYCT-ND; LCSC Part Number: C313354
U16-U21 = IS181GB: Optoisolator Transistor Output 3750Vrms 1 Channel; Manufacturer: Isocom; Forward Current: 50mA; Reverse Breakdown Voltage: 6V; Isolation Voltage: 3.75kV; Rise Time: 18000ns; Power Dissipation: 170mW; Number of Elements: 1; Collector Emitter Saturation Voltage: 200mV; Forward Voltage: 1.4V; Collector Emitter Voltage (VCEO): 80V; Current Transfer Ratio: 600%; Item Type: Optocoupler; Supplier 1: Arrow Electronics; Manufacturer Part Number: IS181GB; RoHS: Yes; Category: Optocouplers; Stock 1: 2922; Pricing 1: 1=0.55080, 10=0.34190, 25=0.33860, 50=0.33530, 100=0.19360, 250=0.19160, 500=0.18960, 1000=0.14750 (USD); Mount: Surface Mount; Case/Package: SMD/SMT; Number of Pins: 4; Min Operating Temperature: -55°C; Max Operating Temperature: 100°C; Fall Time: 18000ns; Radiation Hardening: No; Lead Free: Lead Free; RoHS Compliant: Yes; ComponentLink1URL: https://datasheet.ciiva.com/26895/getdatasheetpartid-624485-26895717.pdf?src-supplier=Verical; ComponentLink1Description: https://datasheet.ciiva.com/26895/getdatasheetpartid-624485-26895717.pdf?src-supplier=Verical; ComponentLink2URL: https://datasheet.ciiva.com/29301/183289-da-01-en-optokoppler-is181-gb-29301106.pdf?src-supplier=Conrad; ComponentLink2Description: https://datasheet.ciiva.com/29301/183289-da-01-en-optokoppler-is181-gb-29301106.pdf?src-supplier=Conrad; Supplier Part Number 1: IS181GB; LCSC Part Number: C84196

## Sheet Connector_Sheet2.SchDoc
size 420 x 297 mm; SheetNumber: 8; SheetTotal: 8
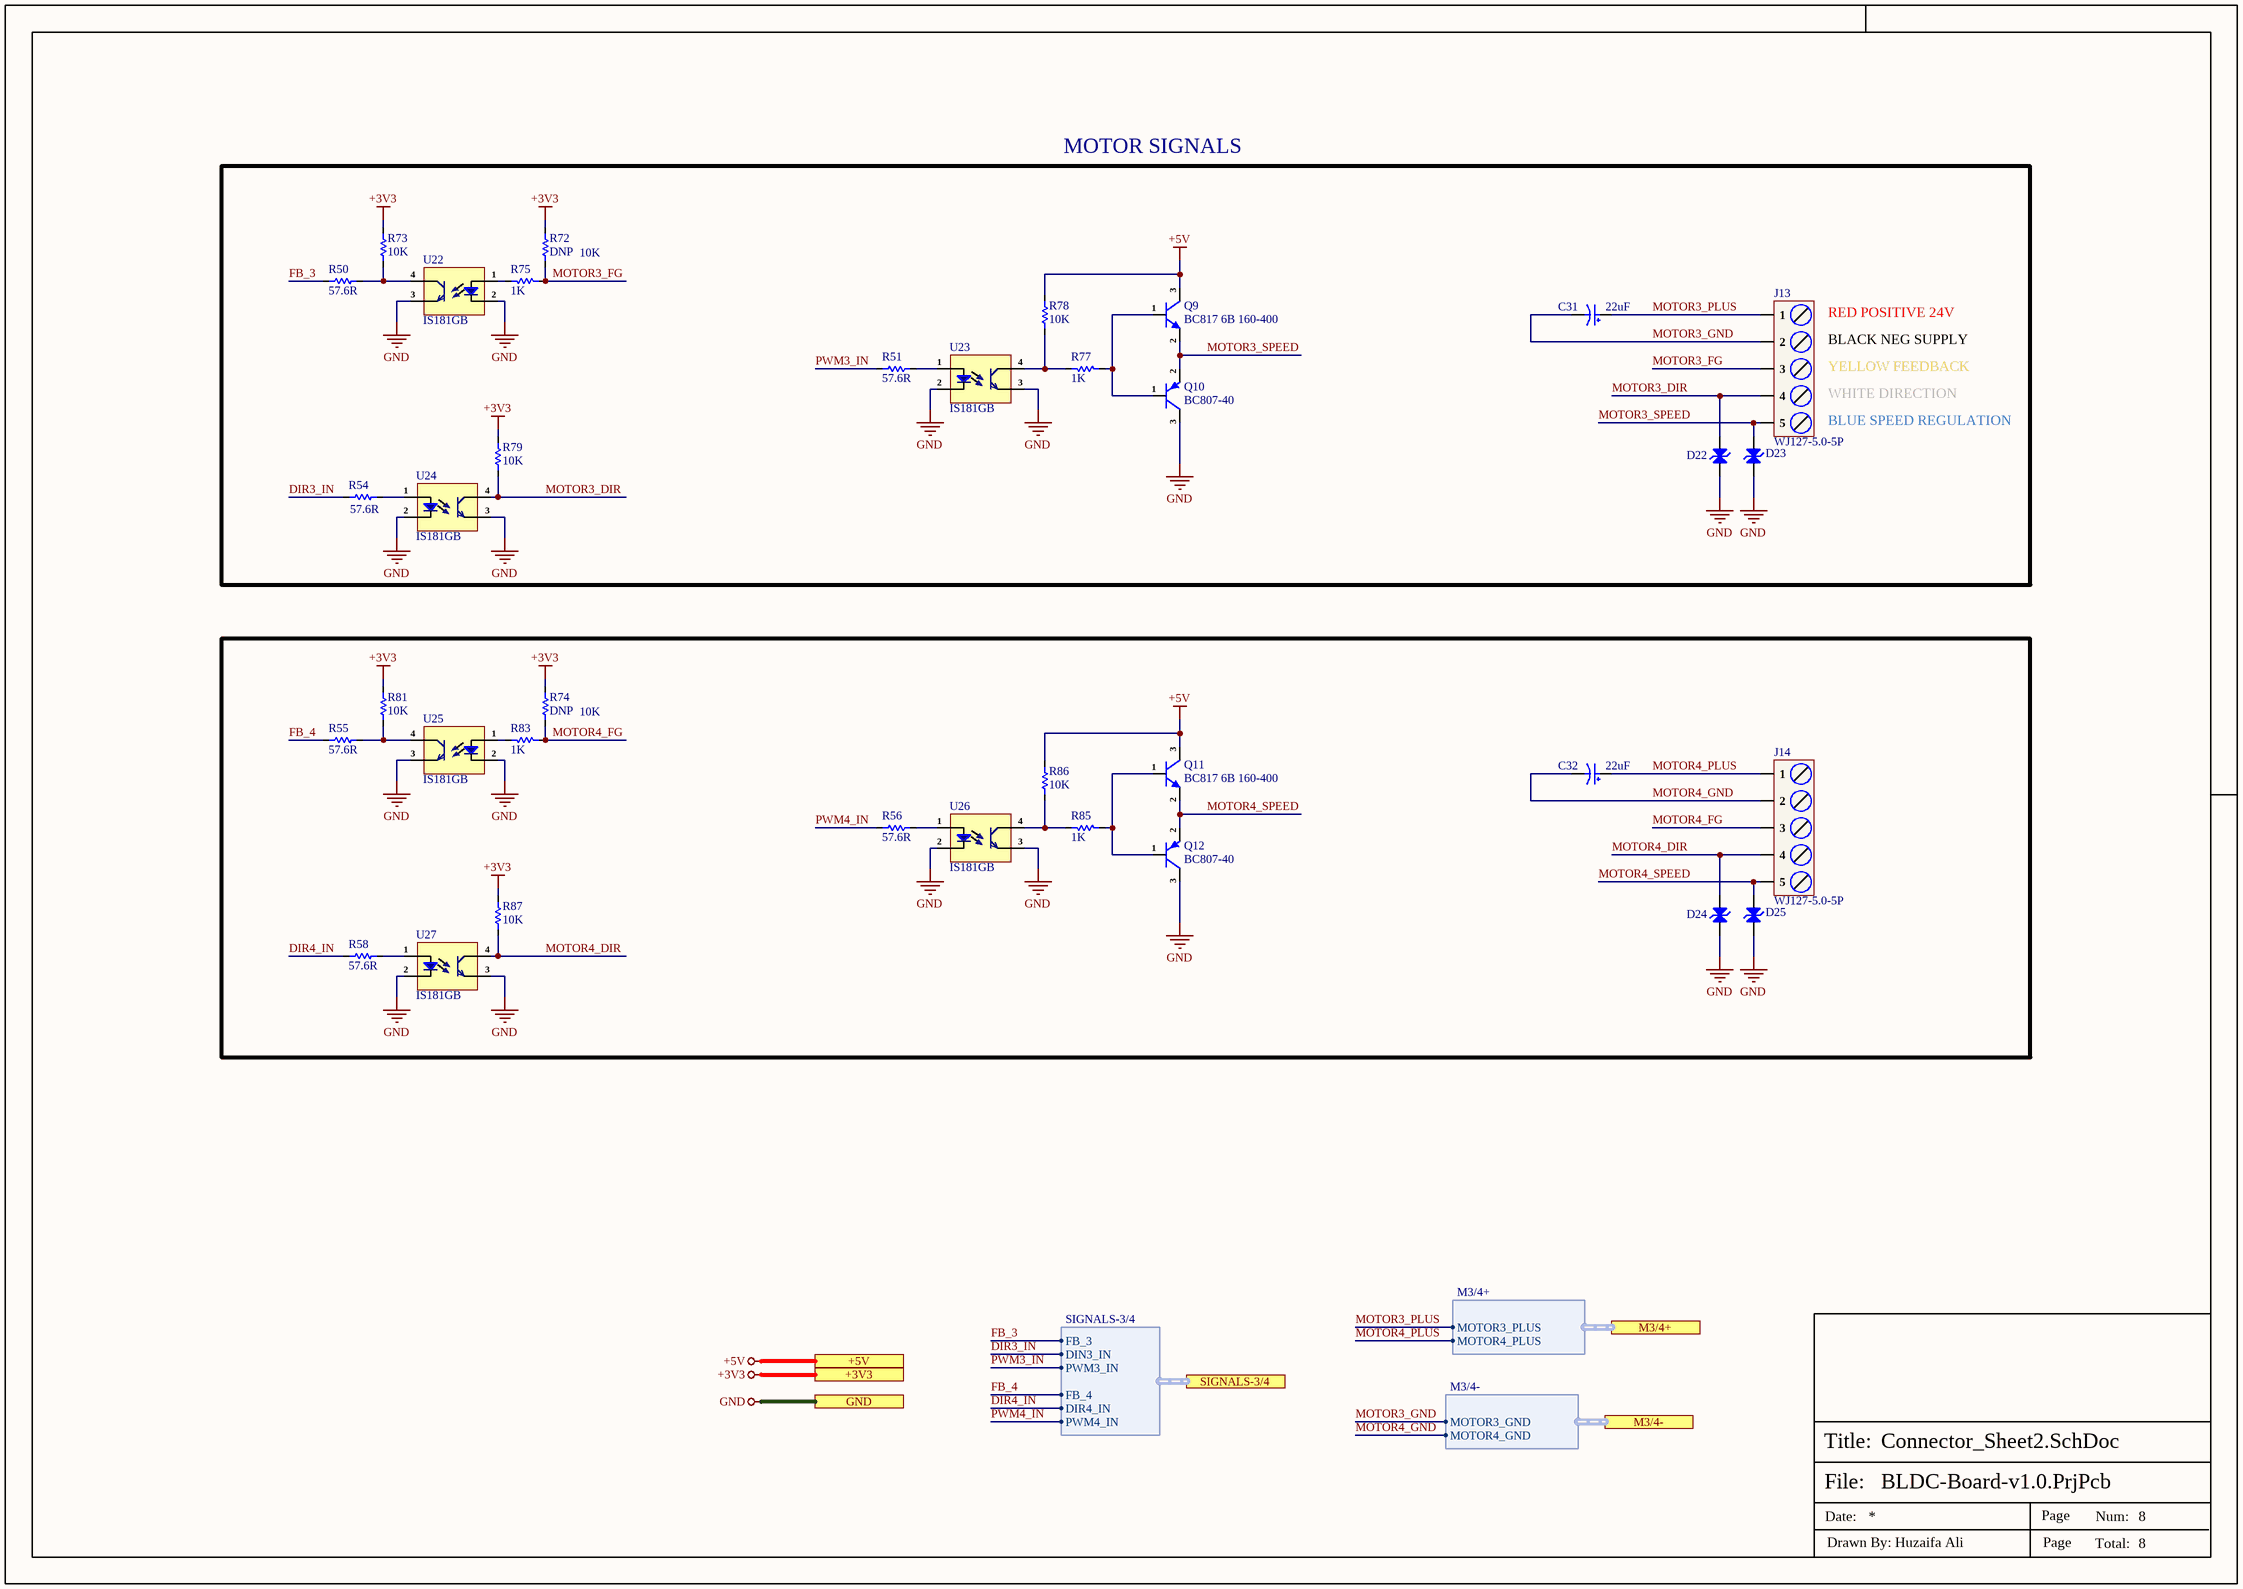
[diagram p3: Connector_Sheet2.SchDoc]

### Parts
C31  22uF  [VKMD1652D220MV]
C32  22uF  [VKMD1652D220MV]
D22  ESD5B5.0ST1G  [SOD-523]  (value not drawn)
D23  ESD5B5.0ST1G  [SOD-523]  (value not drawn)
D24  ESD5B5.0ST1G  [SOD-523]  (value not drawn)
D25  ESD5B5.0ST1G  [SOD-523]  (value not drawn)
J13  WJ127-5.0-5P  [WJ127-5.0-5P]
J14  WJ127-5.0-5P  [WJ127-5.0-5P]
Q9  BC817 6B 160-400  [SOT-23]
Q10  BC807-40  [SOT-23]
Q11  BC817 6B 160-400  [SOT-23]
Q12  BC807-40  [SOT-23]
R50  57.6R  [Res-0402]
R51  57.6R  [Res-0402]
R54  57.6R  [Res-0402]
R55  57.6R  [Res-0402]
R56  57.6R  [Res-0402]
R58  57.6R  [Res-0402]
R72  DNP  [Res-0402]
R73  10K  [Res-0402]
R74  DNP  [Res-0402]
R75  1K  [Res-0402]
R77  1K  [Res-0402]
R78  10K  [Res-0402]
R79  10K  [Res-0402]
R81  10K  [Res-0402]
R83  1K  [Res-0402]
R85  1K  [Res-0402]
R86  10K  [Res-0402]
R87  10K  [Res-0402]
U22  IS181GB  [SOP-4_2.54]
U23  IS181GB  [SOP-4_2.54]
U24  IS181GB  [SOP-4_2.54]
U25  IS181GB  [SOP-4_2.54]
U26  IS181GB  [SOP-4_2.54]
U27  IS181GB  [SOP-4_2.54]

### Blocks framed on the sheet
10K: C32 D24 D25 J14 Q11 Q12 R55 R56 R58 R74 R81 R83 R85-R87 U25-U27

### Ports
+3V3 (see Top_Sheet[3C], CAN_Sheet[5D], Connector_Sheet1[5D], Controller_Sheet[2D], Motor_Driver_Sheet[5D], Power_Sheet[5D], RS485_RS232_Sheet[5D]), +5V (see Top_Sheet[3C], CAN_Sheet[5D], Connector_Sheet1[5D], Power_Sheet[5D]), GND (see Top_Sheet[3C], CAN_Sheet[5D], Connector_Sheet1[5D], Controller_Sheet[2D], Motor_Driver_Sheet[5D], Power_Sheet[5D], RS485_RS232_Sheet[5D]), M3/4+ (harness M3/4+, see Top_Sheet[3C], Motor_Driver_Sheet[3D]), M3/4- (harness M3/4-, see Top_Sheet[3C], Motor_Driver_Sheet[2D]), SIGNALS-3/4 (harness SIGNALS-3/4, see Top_Sheet[4C], Controller_Sheet[1D])

### Harnesses
M3/4+: MOTOR3_PLUS, MOTOR4_PLUS
M3/4-: MOTOR3_GND, MOTOR4_GND
SIGNALS-3/4: FB_3, DIN3_IN, PWM3_IN, FB_4, DIR4_IN, PWM4_IN

### Nets
+3V3: R72.2 R73.2 R74.2 R79.2 R81.2 R87.2 ; port +3V3
+5V: Q9.3(C) Q11.3(C) R78.1 R86.1 ; port +5V
GND: D22.1(A) D23.1(A) D24.1(A) D25.1(A) Q10.3(C) Q12.3(C) U22.2(Ca) U22.3(E) U23.2(Ca) U23.3(E) U24.2(Ca) U24.3(E) U25.2(Ca) U25.3(E) U26.2(Ca) U26.3(E) U27.2(Ca) U27.3(E) ; port GND
DIR3_IN: R54.1 ; port SIGNALS-3/4.DIN3_IN
DIR4_IN: R58.1 ; port SIGNALS-3/4.DIR4_IN
FB_3: R50.1 ; port SIGNALS-3/4.FB_3
FB_4: R55.1 ; port SIGNALS-3/4.FB_4
MOTOR3_DIR: D22.2(A) J13.4 R79.1 U24.4(C)
MOTOR3_FG: J13.3 R72.1 R75.1
MOTOR3_GND: C31.2 J13.2 ; port M3/4-.MOTOR3_GND
MOTOR3_PLUS: C31.1 J13.1 ; port M3/4+.MOTOR3_PLUS
MOTOR3_SPEED: D23.2(A) J13.5 Q9.2(E) Q10.2(E)
MOTOR4_DIR: D24.2(A) J14.4 R87.1 U27.4(C)
MOTOR4_FG: J14.3 R74.1 R83.1
MOTOR4_GND: C32.2 J14.2 ; port M3/4-.MOTOR4_GND
MOTOR4_PLUS: C32.1 J14.1 ; port M3/4+.MOTOR4_PLUS
MOTOR4_SPEED: D25.2(A) J14.5 Q11.2(E) Q12.2(E)
PWM3_IN: R51.1 ; port SIGNALS-3/4.PWM3_IN
PWM4_IN: R56.1 ; port SIGNALS-3/4.PWM4_IN
NetQ9_1: Q9.1(B) Q10.1(B) R77.1
NetQ11_1: Q11.1(B) Q12.1(B) R85.1
NetR50_2: R50.2 R73.1 U22.4(C)
NetR51_2: R51.2 U23.1(An)
NetR54_2: R54.2 U24.1(An)
NetR55_2: R55.2 R81.1 U25.4(C)
NetR56_2: R56.2 U26.1(An)
NetR58_2: R58.2 U27.1(An)
NetR75_2: R75.2 U22.1(An)
NetR77_2: R77.2 R78.2 U23.4(C)
NetR83_2: R83.2 U25.1(An)
NetR85_2: R85.2 R86.2 U26.4(C)

### Notes on the sheet
- MOTOR SIGNALS
- 10K
- RED POSITIVE 24V
- BLACK NEG SUPPLY
- YELLOW FEEDBACK
- WHITE DIRECTION
- BLUE SPEED REGULATION
- File:
- Title:
- Date:
- Page
- Num:
- Total:
- Drawn By: Huzaifa Ali

### Library data of the parts
C31 C32 = VKMD1652D220MV: as C29 on sheet Connector_Sheet1; Manufacturer Part Number: VKMD1652D220MV; Package: SMD,D8xL16.5mm; LCSC Part Number: C487500; Item Type: Electrolytic Capacitor; ComponentLink1Description: LCSC; ComponentLink1URL: https://www.lcsc.com/product-detail/Aluminum-Electrolytic-Capacitors-SMD_Ymin-VKMD1652D220MV_C487500.html
D22-D25 = ESD5B5.0ST1G: as D18 on sheet Connector_Sheet1; Supplier: Future Electronics; Supplier Part Number: 1159725; Manufacturer Part Number: ESD5B5.0ST1G; RoHS: Yes; Category: ESD and Circuit Protection ICs; Stock: 486000; Pricing: 3000=0.0396, 9000=0.0381, 15000=0.0375, 60000=0.0357, 90000=0.0346 (USD); ComponentLink1URL: https://datasheet.ciiva.com/339/esd5b5-0st1g-339772.pdf?src-supplier=Avnet; ComponentLink1Description: https://datasheet.ciiva.com/339/esd5b5-0st1g-339772.pdf?src-supplier=Avnet; ComponentLink2URL: https://datasheet.ciiva.com/339/esd5b5-0st1g-339772.pdf?src-supplier=Digi-Key; ComponentLink2Description: https://datasheet.ciiva.com/339/esd5b5-0st1g-339772.pdf?src-supplier=Digi-Key; ComponentLink3URL: https://datasheet.ciiva.com/22637/716649-22637178.pdf?src-supplier=Element14; ComponentLink3Description: https://datasheet.ciiva.com/22637/716649-22637178.pdf?src-supplier=Element14; ComponentLink4URL: https://datasheet.ciiva.com/4510/esd5b5-0st1g-241623-4510548.pdf?src-supplier=Mouser; ComponentLink4Description: https://datasheet.ciiva.com/4510/esd5b5-0st1g-241623-4510548.pdf?src-supplier=Mouser; ComponentLink5URL: https://datasheet.ciiva.com/339/esd5b5-0st1-d-339773.pdf?src-supplier=Digi-Key; ComponentLink5Description: https://datasheet.ciiva.com/339/esd5b5-0st1-d-339773.pdf?src-supplier=Digi-Key; ComponentLink6URL: https://datasheet.ciiva.com/339/esd5b5-0st1-d-339774.pdf?src-supplier=Digi-Key; ComponentLink6Description: https://datasheet.ciiva.com/339/esd5b5-0st1-d-339774.pdf?src-supplier=Digi-Key; LCSC Part Number: C93623
J13 J14 = WJ127-5.0-5P: as J8 on sheet Connector_Sheet1; ComponentLink1Description: LCSC; ComponentLink1URL: https://www.lcsc.com/product-detail/Screw-terminal_Ningbo-Kangnex-Elec-WJ127-5-0-5P_C192780.html; Manufacturer Part Number: WJ127-5.0-5P; Package: Plugin,P=5mm; LCSC Part Number: C192780; Item Type: Screw terminal
Q9 Q11 = BC817 6B 160-400: as Q5 on sheet Connector_Sheet1; Manufacturer Part Number: BC817 6B 160-400; Package: SOT-23; LCSC Part Number: C371086; Item Type: Transistor; ComponentLink1Description: LCSC; ComponentLink1URL: https://www.lcsc.com/product-detail/Bipolar-Transistors-BJT_DOWO-BC817-6B-160-400_C371086.html
Q10 Q12 = BC807-40: as Q6 on sheet Connector_Sheet1; Manufacturer Part Number: BC807-40; Package: SOT-23; LCSC Part Number: C489159; ComponentLink1Description: LCSC; ComponentLink1URL: https://www.lcsc.com/product-detail/Bipolar-BJT_KEXIN-BC807-40_C489159.html
R50 R51 R54-R56 R58 = ERJ-2RKF57R6X: as R38 on sheet Connector_Sheet1; Supplier: Mouser; Supplier Part Number: 667-ERJ-2RKF57R6X; Manufacturer Part Number: ERJ-2RKF57R6X; RoHS: Yes; Stock: 32931; Pricing: 1=0.1, 10=0.015, 50=0.015, 100=0.009, 1000=0.006, 10000=0.003 (USD); ComponentLink1URL: https://datasheet.ciiva.com/9188/aoa0000ce2-9188571.pdf?src-supplier=Avnet; ComponentLink1Description: https://datasheet.ciiva.com/9188/aoa0000ce2-9188571.pdf?src-supplier=Avnet; ComponentLink2URL: https://datasheet.ciiva.com/9188/aoa0000ce2-9188574.pdf?src-supplier=Avnet; ComponentLink2Description: https://datasheet.ciiva.com/9188/aoa0000ce2-9188574.pdf?src-supplier=Avnet; ComponentLink3URL: https://datasheet.ciiva.com/24026/aoa0000ce2-24026248.pdf?src-supplier=Mouser; ComponentLink3Description: https://datasheet.ciiva.com/24026/aoa0000ce2-24026248.pdf?src-supplier=Mouser; ComponentLink4URL: https://datasheet.ciiva.com/43467/1678782-43467198.pdf?src-supplier=Farnell; ComponentLink4Description: https://datasheet.ciiva.com/43467/1678782-43467198.pdf?src-supplier=Farnell; ComponentLink5URL: https://datasheet.ciiva.com/46372/1678782-46372935.pdf?src-supplier=Element14; ComponentLink5Description: https://datasheet.ciiva.com/46372/1678782-46372935.pdf?src-supplier=Element14; ComponentLink6URL: https://datasheet.ciiva.com/46372/1678782-46372936.pdf?src-supplier=Element14; ComponentLink6Description: https://datasheet.ciiva.com/46372/1678782-46372936.pdf?src-supplier=Element14; ComponentLink7URL: https://datasheet.ciiva.com/22668/1678782-22668391.pdf?src-supplier=Element14; ComponentLink7Description: https://datasheet.ciiva.com/22668/1678782-22668391.pdf?src-supplier=Element14; ComponentLink8URL: https://datasheet.ciiva.com/22743/1678782-22743894.pdf?src-supplier=Element14; ComponentLink8Description: https://datasheet.ciiva.com/22743/1678782-22743894.pdf?src-supplier=Element14; ComponentLink9URL: https://datasheet.ciiva.com/30107/aoa0000ce2-30107676.pdf?src-supplier=Onlinecomponents.com; ComponentLink9Description: https://datasheet.ciiva.com/30107/aoa0000ce2-30107676.pdf?src-supplier=Onlinecomponents.com; LCSC Part Number: C3025671
R72-R74 R78 R79 R81 R86 R87 = RC0402FR-0710KL: as R57 on sheet Connector_Sheet1; Supplier 1: Mouser; Manufacturer Part Number: RC0402FR-0710KL; RoHS: Yes; Category: Chip SMD Resistors; Stock 1: 18648329; Pricing 1: 1=0.10000, 10=0.01400, 50=0.01400, 100=0.00500, 1000=0.00300, 10000=0.00200 (USD); Case/Package: 0402; Number of Pins: 2; Case Code (Imperial): 0402; Case Code (Metric): 1005; Min Operating Temperature: -55°C; Max Operating Temperature: 155°C; Resistor Type: Thick Film; Tolerance: 1%; Packaging: Tape and Reel; Voltage Rating: 50V; Termination: SMD/SMT; Working Voltage: 50V; Number of Terminations: 2; Features: Moisture Resistant; Series: RC; Resistance Tolerance: 1%; Construction: Rectangular; Length: 1mm; Width: 0.5mm; Height: 0.32mm; Depth: 0.5mm; Lead Pitch: 0.2mm; REACH SVHC: No SVHC; Lead Free: Lead Free; RoHS Compliant: Yes; Military Standard: Not; ComponentLink1URL: https://datasheet.ciiva.com/7660/38568-7660787.pdf?src-supplier=Element14; ComponentLink1Description: https://datasheet.ciiva.com/7660/38568-7660787.pdf?src-supplier=Element14; ComponentLink2URL: https://datasheet.ciiva.com/7849/1686128-7849814.pdf?src-supplier=Element14; ComponentLink2Description: https://datasheet.ciiva.com/7849/1686128-7849814.pdf?src-supplier=Element14; ComponentLink3URL: https://datasheet.ciiva.com/7983/1018594-7983486.pdf?src-supplier=Element14; ComponentLink3Description: https://datasheet.ciiva.com/7983/1018594-7983486.pdf?src-supplier=Element14; ComponentLink4URL: https://datasheet.ciiva.com/22747/1018594-22747512.pdf?src-supplier=Element14; ComponentLink4Description: https://datasheet.ciiva.com/22747/1018594-22747512.pdf?src-supplier=Element14; ComponentLink5URL: https://datasheet.ciiva.com/12667/pyu-rc0402-51-rohs-l-6-r-12667067.pdf?src-supplier=Mouser; ComponentLink5Description: https://datasheet.ciiva.com/12667/pyu-rc0402-51-rohs-l-6-r-12667067.pdf?src-supplier=Mouser; ComponentLink6URL: https://datasheet.ciiva.com/7849/1784430-7849813.pdf?src-supplier=Element14; ComponentLink6Description: https://datasheet.ciiva.com/7849/1784430-7849813.pdf?src-supplier=Element14; ComponentLink7URL: https://datasheet.ciiva.com/7849/1784430-7849815.pdf?src-supplier=Element14; ComponentLink7Description: https://datasheet.ciiva.com/7849/1784430-7849815.pdf?src-supplier=Element14; Supplier Part Number 1: 603-RC0402FR-0710KL; LCSC Part Number: C60490
R75 R77 R83 R85 = CRCW04021K00FKEDHP: as R59 on sheet Connector_Sheet1; Supplier 1: Digi-Key; Manufacturer Part Number: CRCW04021K00FKEDHP; Stock 1: 315989; Pricing 1: 1=0.15, 10=0.132, 100=0.0506, 1000=0.02226, 2500=0.01923, 5000=0.0172 (USD); Mount: Surface Mount; Case/Package: 0402; Number of Pins: 2; Contact Plating: Tin; Weight: 2.3E-05oz; Case Code (Imperial): 0402; Case Code (Metric): 1005; Size Code: 0402; Min Operating Temperature: -55°C; Max Operating Temperature: 155°C; Tolerance: 1%; Resistor Type: Thick Film; Package Quantity: 10; Packaging: Tape and Reel; Number of Terminations: 2; Termination: SMD/SMT; Max Power Dissipation: 125mW; Voltage Rating (DC): 50V; Features: Automotive AEC-Q200; Series: CRCW-HP; Construction: Rectangular; Technology: THICK FILM; Resistance Tolerance: 1%; Length: 1mm; Width: 0.5mm; Height: 0.3mm; Depth: 0.5mm; Radiation Hardening: No; REACH SVHC: Unknown; Military Standard: Not; Lead Free: Lead Free; RoHS Compliant: Yes; ComponentLink1URL: http://www.farnell.com/datasheets/2339608.pdf?src-supplier=Element14; ComponentLink1Description: http://www.farnell.com/datasheets/2339608.pdf?src-supplier=Element14; ComponentLink2URL: http://www.vishay.com/docs/20043/crcwhpe3.pdf?src-supplier=Digi-Key; ComponentLink2Description: http://www.vishay.com/docs/20043/crcwhpe3.pdf?src-supplier=Digi-Key; ComponentLink3URL: http://www.mouser.com/ds/2/427/crcwhpe3-46056.pdf?src-supplier=Mouser; ComponentLink3Description: http://www.mouser.com/ds/2/427/crcwhpe3-46056.pdf?src-supplier=Mouser; ComponentLink4URL: http://www.vishay.com/docs/20043/crcwhpe3.pdf?src-supplier=Avnet; ComponentLink4Description: http://www.vishay.com/docs/20043/crcwhpe3.pdf?src-supplier=Avnet; ComponentLink5URL: http://www.vishay.com/docs/20043/crcwhpe3.pdf?src-supplier=Future+Electronics; ComponentLink5Description: http://www.vishay.com/docs/20043/crcwhpe3.pdf?src-supplier=Future+Electronics; Supplier Part Number 1: 541-1.00KYCT-ND; LCSC Part Number: C313354
U22-U27 = IS181GB: as U16 on sheet Connector_Sheet1; Supplier 1: Arrow Electronics; Manufacturer Part Number: IS181GB; RoHS: Yes; Category: Optocouplers; Stock 1: 2922; Pricing 1: 1=0.55080, 10=0.34190, 25=0.33860, 50=0.33530, 100=0.19360, 250=0.19160, 500=0.18960, 1000=0.14750 (USD); Mount: Surface Mount; Case/Package: SMD/SMT; Number of Pins: 4; Min Operating Temperature: -55°C; Max Operating Temperature: 100°C; Fall Time: 18000ns; Radiation Hardening: No; Lead Free: Lead Free; RoHS Compliant: Yes; ComponentLink1URL: https://datasheet.ciiva.com/26895/getdatasheetpartid-624485-26895717.pdf?src-supplier=Verical; ComponentLink1Description: https://datasheet.ciiva.com/26895/getdatasheetpartid-624485-26895717.pdf?src-supplier=Verical; ComponentLink2URL: https://datasheet.ciiva.com/29301/183289-da-01-en-optokoppler-is181-gb-29301106.pdf?src-supplier=Conrad; ComponentLink2Description: https://datasheet.ciiva.com/29301/183289-da-01-en-optokoppler-is181-gb-29301106.pdf?src-supplier=Conrad; Supplier Part Number 1: IS181GB; LCSC Part Number: C84196